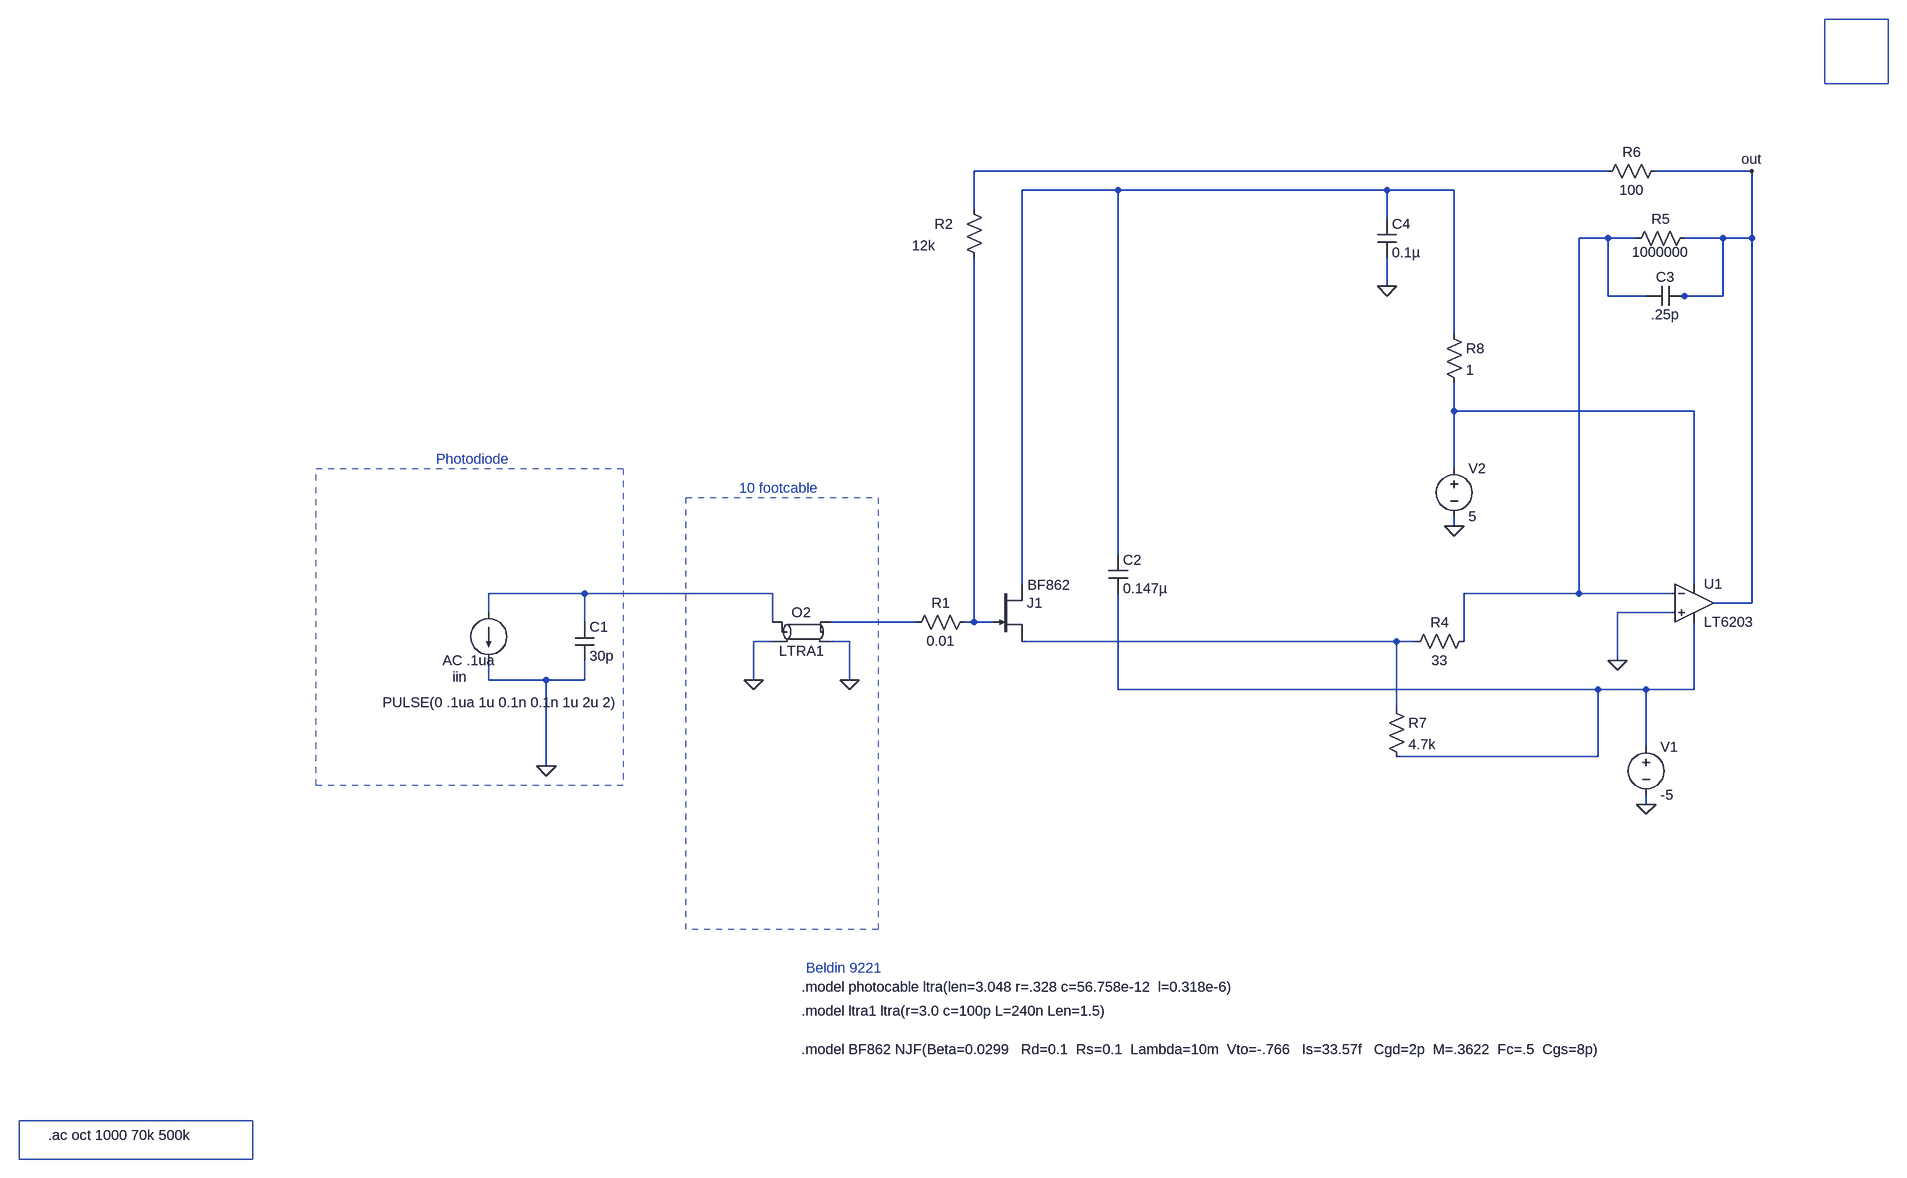
[diagram p0: schematic 6203 cable&bootstrap_4_02_10ac analysis.asc]
6203 cable&bootstrap_4_02_10ac analysis.asc, the LTspice schematic file:
Version 4
SHEET 1 2740 2124
WIRE -1280 -544 -2336 -544
WIRE -1040 -544 -1200 -544
WIRE -2096 -512 -2256 -512
WIRE -1648 -512 -2096 -512
WIRE -1536 -512 -1648 -512
WIRE -2336 -480 -2336 -544
WIRE -1648 -464 -1648 -512
WIRE -1280 -432 -1328 -432
WIRE -1232 -432 -1280 -432
WIRE -1088 -432 -1152 -432
WIRE -1040 -432 -1040 -544
WIRE -1040 -432 -1088 -432
WIRE -1648 -352 -1648 -400
WIRE -1280 -336 -1280 -432
WIRE -1216 -336 -1280 -336
WIRE -1152 -336 -1168 -336
WIRE -1088 -336 -1088 -432
WIRE -1088 -336 -1152 -336
WIRE -1536 -272 -1536 -512
WIRE -1536 -144 -1536 -192
WIRE -1136 -144 -1536 -144
WIRE -1536 -48 -1536 -144
WIRE -1536 48 -1536 32
WIRE -2096 96 -2096 -512
WIRE -2256 144 -2256 -512
WIRE -1136 144 -1136 -144
WIRE -3152 160 -3312 160
WIRE -2672 160 -3152 160
WIRE -1328 160 -1328 -432
WIRE -1328 160 -1520 160
WIRE -1168 160 -1328 160
WIRE -1040 176 -1040 -432
WIRE -1040 176 -1104 176
WIRE -3312 192 -3312 160
WIRE -1168 192 -1264 192
WIRE -3152 208 -3152 160
WIRE -2672 208 -2672 160
WIRE -2432 208 -2576 208
WIRE -2336 208 -2336 -400
WIRE -2336 208 -2352 208
WIRE -2304 208 -2336 208
WIRE -2672 240 -2704 240
WIRE -2544 240 -2576 240
WIRE -1632 240 -2256 240
WIRE -1600 240 -1632 240
WIRE -1520 240 -1520 160
WIRE -1264 272 -1264 192
WIRE -3312 304 -3312 272
WIRE -3216 304 -3312 304
WIRE -3152 304 -3152 272
WIRE -3152 304 -3216 304
WIRE -2704 304 -2704 240
WIRE -2544 304 -2544 240
WIRE -2096 320 -2096 160
WIRE -1296 320 -2096 320
WIRE -1216 320 -1296 320
WIRE -1136 320 -1136 208
WIRE -1136 320 -1216 320
WIRE -1632 352 -1632 240
WIRE -1216 416 -1216 320
WIRE -1296 432 -1296 320
WIRE -1296 432 -1632 432
WIRE -3216 448 -3216 304
WIRE -1216 512 -1216 496
FLAG -1216 512 0
FLAG -1536 48 0
FLAG -1264 272 0
FLAG -1040 -544 out
FLAG -1648 -352 0
FLAG -2544 304 0
FLAG -2704 304 0
FLAG -3216 448 0
SYMBOL njf -2304 144 R0
WINDOW 3 57 2 Left 0
SYMATTR Value BF862
SYMATTR InstName J1
SYMBOL current -3312 192 R0
WINDOW 123 -77 80 Left 0
WINDOW 39 0 0 Left 0
WINDOW 0 -60 107 Left 0
WINDOW 3 -177 150 Left 0
SYMATTR Value2 AC .1ua
SYMATTR InstName iin
SYMATTR Value PULSE(0 .1ua 1u 0.1n 0.1n 1u 2u 2)
SYMBOL cap -3168 208 R0
SYMATTR InstName C1
SYMATTR Value 30p
SYMBOL res -2336 192 R90
WINDOW 0 0 56 VBottom 0
WINDOW 3 32 56 VTop 0
SYMATTR InstName R1
SYMATTR Value 0.01
SYMBOL res -2352 -496 R0
WINDOW 0 -50 40 Left 0
WINDOW 3 -88 76 Left 0
SYMATTR InstName R2
SYMATTR Value 12k
SYMBOL cap -2112 96 R0
SYMATTR InstName C2
SYMATTR Value 0.147µ
SYMBOL voltage -1216 400 R0
WINDOW 123 0 0 Left 0
WINDOW 39 0 0 Left 0
SYMATTR InstName V1
SYMATTR Value -5
SYMBOL voltage -1536 -64 R0
WINDOW 123 0 0 Left 0
WINDOW 39 0 0 Left 0
SYMATTR InstName V2
SYMATTR Value 5
SYMBOL res -1504 224 R90
WINDOW 0 0 56 VBottom 0
WINDOW 3 32 56 VTop 0
SYMATTR InstName R4
SYMATTR Value 33
SYMBOL res -1184 -560 R90
WINDOW 0 0 56 VBottom 0
WINDOW 3 32 56 VTop 0
SYMATTR InstName R6
SYMATTR Value 100
SYMBOL res -1136 -448 R90
WINDOW 0 0 56 VBottom 0
WINDOW 3 55 56 VBottom 0
SYMATTR InstName R5
SYMATTR Value 1000000
SYMBOL ltline -2624 224 R0
SYMATTR InstName O2
SYMATTR Value LTRA1
SYMBOL cap -1152 -352 R90
WINDOW 0 0 32 VBottom 0
WINDOW 3 32 32 VTop 0
SYMATTR InstName C3
SYMATTR Value .25p
SYMBOL res -1648 336 R0
SYMATTR InstName R7
SYMATTR Value 4.7k
SYMBOL res -1552 -288 R0
SYMATTR InstName R8
SYMATTR Value 1
SYMBOL cap -1664 -464 R0
SYMATTR InstName C4
SYMATTR Value 0.1µ
SYMBOL Opamps\\LT6203 -1136 176 R0
SYMATTR InstName U1
TEXT -4480 2080 Left 0 !.ac oct 1000 70k 500k
TEXT -2624 816 Left 0 !.model photocable ltra(len=3.048 r=.328 c=56.758e-12  l=0.318e-6)
TEXT -2624 856 Left 0 !.model ltra1 ltra(r=3.0 c=100p L=240n Len=1.5)
TEXT -2616 784 Left 0 ;Beldin 9221
TEXT -3400 -64 Left 0 ;Photodiode
TEXT -2728 -16 Left 0 ;10 footcable
TEXT -2624 920 Left 0 !.model BF862 NJF(Beta=0.0299   Rd=0.1  Rs=0.1  Lambda=10m  Vto=-.766   Is=33.57f   Cgd=2p  M=.3622  Fc=.5  Cgs=8p)
RECTANGLE Normal -4112 2120 -4528 2056
RECTANGLE Normal 2736 -1120 2464 -1264
RECTANGLE Normal -2496 720 -2816 0 1
RECTANGLE Normal -3088 480 -3600 -48 1

The netlist it stands for:
* 6203 cable&bootstrap_4_02_10ac analysis.asc
J1 N002 N007 N008 BF862
iin N005 0 PULSE(0 .1ua 1u 0.1n 0.1n 1u 2u 2) AC .1ua
C1 N005 0 30p
R1 N007 N006 0.01
R2 N001 N007 12k
C2 N002 N009 0.147µ
V1 N009 0 -5
V2 N004 0 5
R4 N003 N008 33
R6 out N001 100
R5 out N003 1000000
O2 N005 0 N006 0 LTRA1
C3 out N003 .25p
R7 N008 N009 4.7k
R8 N002 N004 1
C4 N002 0 0.1µ
* U1: LT6203 (symbol Opamps\LT6203 not available, pins judged from their places): In+=0 In-=N003 V+=N004 V-=N009 OUT=out
.model NJF NJF
.model PJF PJF
.lib standard.jft
.ac oct 1000 70k 500k
.model photocable ltra(len=3.048 r=.328 c=56.758e-12  l=0.318e-6)
.model ltra1 ltra(r=3.0 c=100p L=240n Len=1.5)
* Beldin 9221
* Photodiode
* 10 footcable
.model BF862 NJF(Beta=0.0299   Rd=0.1  Rs=0.1  Lambda=10m  Vto=-.766   Is=33.57f   Cgd=2p  M=.3622  Fc=.5  Cgs=8p)
.backanno
.end